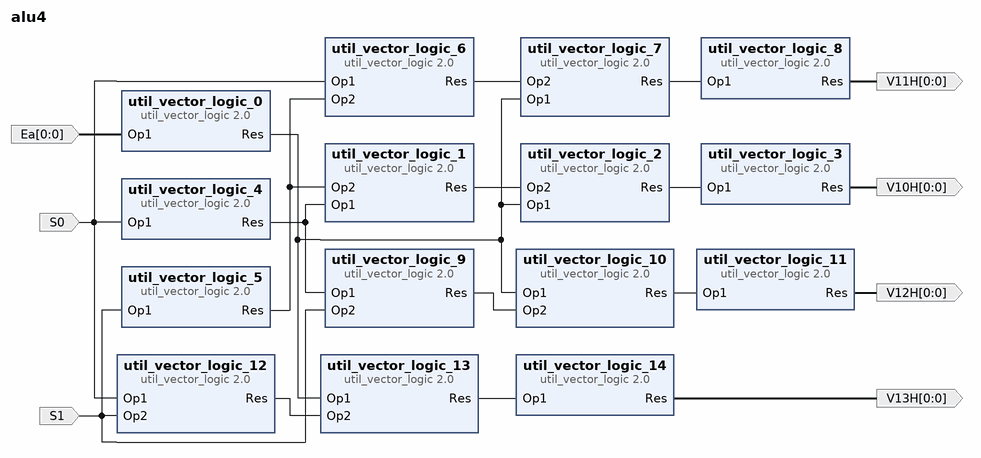
[diagram p0: block diagram of the top level]
# Vivado block design alu4, xc7a35tcsg324-3, Vivado 2018.1
create_bd_design alu4

create_bd_port -dir I S0
create_bd_port -dir I S1
create_bd_port -dir O -from 0 -to 0 V10H
create_bd_port -dir O -from 0 -to 0 V11H
create_bd_port -dir O -from 0 -to 0 V12H
create_bd_port -dir O -from 0 -to 0 V13H
create_bd_port -dir I -from 0 -to 0 Ea

create_bd_cell -type ip -vlnv xilinx.com:ip:util_vector_logic:2.0 util_vector_logic_0
set_property -dict {CONFIG.C_SIZE 1 CONFIG.C_OPERATION not} [get_bd_cells util_vector_logic_0]
create_bd_cell -type ip -vlnv xilinx.com:ip:util_vector_logic:2.0 util_vector_logic_1
set_property -dict {CONFIG.C_SIZE 1 CONFIG.C_OPERATION and} [get_bd_cells util_vector_logic_1]
create_bd_cell -type ip -vlnv xilinx.com:ip:util_vector_logic:2.0 util_vector_logic_2
set_property -dict {CONFIG.C_SIZE 1 CONFIG.C_OPERATION and} [get_bd_cells util_vector_logic_2]
create_bd_cell -type ip -vlnv xilinx.com:ip:util_vector_logic:2.0 util_vector_logic_3
set_property -dict {CONFIG.C_SIZE 1 CONFIG.C_OPERATION not} [get_bd_cells util_vector_logic_3]
create_bd_cell -type ip -vlnv xilinx.com:ip:util_vector_logic:2.0 util_vector_logic_4
set_property -dict {CONFIG.C_SIZE 1 CONFIG.C_OPERATION not} [get_bd_cells util_vector_logic_4]
create_bd_cell -type ip -vlnv xilinx.com:ip:util_vector_logic:2.0 util_vector_logic_5
set_property -dict {CONFIG.C_SIZE 1 CONFIG.C_OPERATION not} [get_bd_cells util_vector_logic_5]
create_bd_cell -type ip -vlnv xilinx.com:ip:util_vector_logic:2.0 util_vector_logic_6
set_property -dict {CONFIG.C_SIZE 1 CONFIG.C_OPERATION and} [get_bd_cells util_vector_logic_6]
create_bd_cell -type ip -vlnv xilinx.com:ip:util_vector_logic:2.0 util_vector_logic_7
set_property -dict {CONFIG.C_SIZE 1 CONFIG.C_OPERATION and} [get_bd_cells util_vector_logic_7]
create_bd_cell -type ip -vlnv xilinx.com:ip:util_vector_logic:2.0 util_vector_logic_8
set_property -dict {CONFIG.C_SIZE 1 CONFIG.C_OPERATION not} [get_bd_cells util_vector_logic_8]
create_bd_cell -type ip -vlnv xilinx.com:ip:util_vector_logic:2.0 util_vector_logic_9
set_property -dict {CONFIG.C_SIZE 1 CONFIG.C_OPERATION and} [get_bd_cells util_vector_logic_9]
create_bd_cell -type ip -vlnv xilinx.com:ip:util_vector_logic:2.0 util_vector_logic_10
set_property -dict {CONFIG.C_SIZE 1 CONFIG.C_OPERATION and} [get_bd_cells util_vector_logic_10]
create_bd_cell -type ip -vlnv xilinx.com:ip:util_vector_logic:2.0 util_vector_logic_11
set_property -dict {CONFIG.C_SIZE 1 CONFIG.C_OPERATION not} [get_bd_cells util_vector_logic_11]
create_bd_cell -type ip -vlnv xilinx.com:ip:util_vector_logic:2.0 util_vector_logic_12
set_property -dict {CONFIG.C_SIZE 1 CONFIG.C_OPERATION and} [get_bd_cells util_vector_logic_12]
create_bd_cell -type ip -vlnv xilinx.com:ip:util_vector_logic:2.0 util_vector_logic_13
set_property -dict {CONFIG.C_SIZE 1 CONFIG.C_OPERATION and} [get_bd_cells util_vector_logic_13]
create_bd_cell -type ip -vlnv xilinx.com:ip:util_vector_logic:2.0 util_vector_logic_14
set_property -dict {CONFIG.C_SIZE 1 CONFIG.C_OPERATION not} [get_bd_cells util_vector_logic_14]

# ---- connections ----

connect_bd_net [get_bd_pins util_vector_logic_0/Res] \
  [get_bd_pins util_vector_logic_2/Op1] [get_bd_pins util_vector_logic_7/Op1] [get_bd_pins util_vector_logic_10/Op1] \
  [get_bd_pins util_vector_logic_13/Op1]
connect_bd_net [get_bd_pins util_vector_logic_1/Res] [get_bd_pins util_vector_logic_2/Op2]
connect_bd_net [get_bd_pins util_vector_logic_2/Res] [get_bd_pins util_vector_logic_3/Op1]
connect_bd_net [get_bd_pins util_vector_logic_6/Res] [get_bd_pins util_vector_logic_7/Op2]
connect_bd_net [get_bd_pins util_vector_logic_7/Res] [get_bd_pins util_vector_logic_8/Op1]
connect_bd_net [get_bd_pins util_vector_logic_4/Res] [get_bd_pins util_vector_logic_1/Op1] [get_bd_pins util_vector_logic_9/Op1]
connect_bd_net [get_bd_pins util_vector_logic_5/Res] [get_bd_pins util_vector_logic_1/Op2] [get_bd_pins util_vector_logic_6/Op2]
connect_bd_net [get_bd_ports S0] [get_bd_pins util_vector_logic_4/Op1] [get_bd_pins util_vector_logic_6/Op1] [get_bd_pins util_vector_logic_12/Op1]
connect_bd_net [get_bd_ports S1] [get_bd_pins util_vector_logic_5/Op1] [get_bd_pins util_vector_logic_9/Op2] [get_bd_pins util_vector_logic_12/Op2]
connect_bd_net [get_bd_pins util_vector_logic_9/Res] [get_bd_pins util_vector_logic_10/Op2]
connect_bd_net [get_bd_pins util_vector_logic_10/Res] [get_bd_pins util_vector_logic_11/Op1]
connect_bd_net [get_bd_pins util_vector_logic_12/Res] [get_bd_pins util_vector_logic_13/Op2]
connect_bd_net [get_bd_pins util_vector_logic_13/Res] [get_bd_pins util_vector_logic_14/Op1]
connect_bd_net [get_bd_pins util_vector_logic_3/Res] [get_bd_ports V10H]
connect_bd_net [get_bd_pins util_vector_logic_8/Res] [get_bd_ports V11H]
connect_bd_net [get_bd_pins util_vector_logic_11/Res] [get_bd_ports V12H]
connect_bd_net [get_bd_pins util_vector_logic_14/Res] [get_bd_ports V13H]
connect_bd_net -net Op1_0_1 [get_bd_ports Ea] [get_bd_pins util_vector_logic_0/Op1]

validate_bd_design
save_bd_design
